# EAGLE schematic cryobondr-qbit2-pqc (EAGLE 6.1)
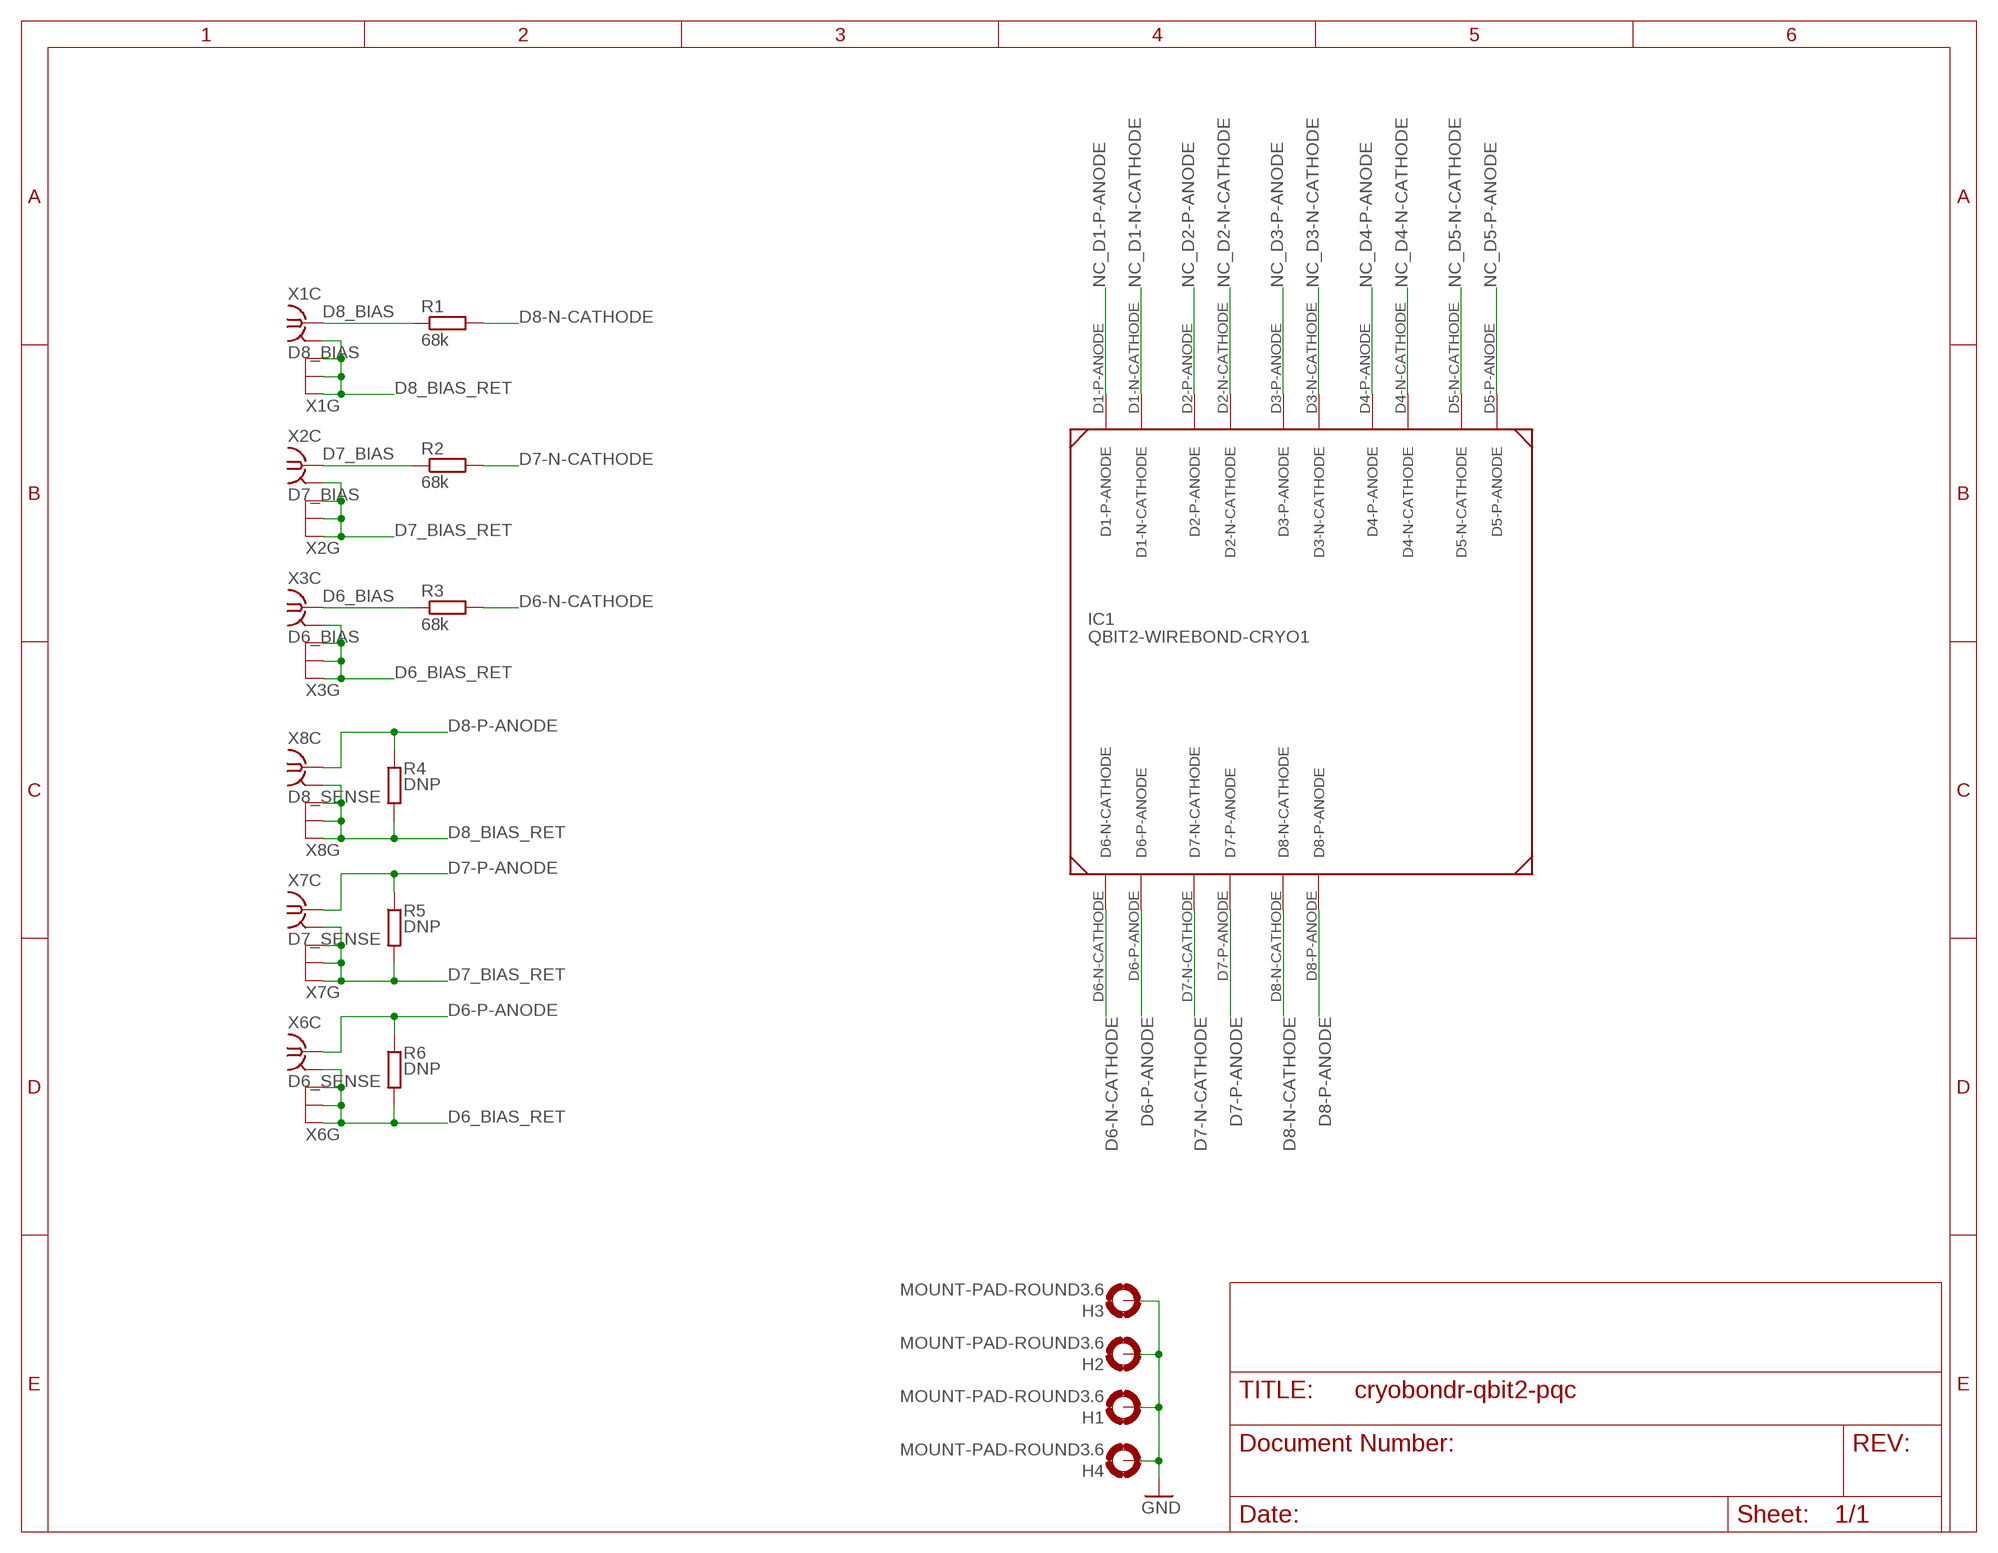
[diagram p0: schematic, sheet 1]

## Parts
H1  MOUNT-PAD-ROUND3.6  [3,6-PAD]
H2  MOUNT-PAD-ROUND3.6  [3,6-PAD]
H3  MOUNT-PAD-ROUND3.6  [3,6-PAD]
H4  MOUNT-PAD-ROUND3.6  [3,6-PAD]
IC1  QBIT2-WIREBOND-CRYO1  [QBIT2-WIREBOND-CRYO1]
R1  68k  R-EU_R0603  [R0603]
R2  68k  R-EU_R0603  [R0603]
R3  68k  R-EU_R0603  [R0603]
R4  DNP  R-EU_R0603  [R0603]
R5  DNP  R-EU_R0603  [R0603]
R6  DNP  R-EU_R0603  [R0603]
X1  D8_BIAS  MMCX  [MMCX-SMT]
X2  D7_BIAS  MMCX  [MMCX-SMT]
X3  D6_BIAS  MMCX  [MMCX-SMT]
X6  D6_SENSE  MMCX  [MMCX-SMT]
X7  D7_SENSE  MMCX  [MMCX-SMT]
X8  D8_SENSE  MMCX  [MMCX-SMT]

## Nets
D6-N-CATHODE: IC1.D6-N-CATHODE R3.2
D6-P-ANODE: IC1.D6-P-ANODE R6.1 X6.S
D6_BIAS: R3.1 X3.S
D6_BIAS_RET: R6.2 X3.G1(C:GND) X3.G2(G:GND) X3.G3(G:GND) X3.G4(G:GND) X6.G1(C:GND) X6.G2(G:GND) X6.G3(G:GND) X6.G4(G:GND)
D7-N-CATHODE: IC1.D7-N-CATHODE R2.2
D7-P-ANODE: IC1.D7-P-ANODE R5.1 X7.S
D7_BIAS: R2.1 X2.S
D7_BIAS_RET: R5.2 X2.G1(C:GND) X2.G2(G:GND) X2.G3(G:GND) X2.G4(G:GND) X7.G1(C:GND) X7.G2(G:GND) X7.G3(G:GND) X7.G4(G:GND)
D8-N-CATHODE: IC1.D8-N-CATHODE R1.2
D8-P-ANODE: IC1.D8-P-ANODE R4.1 X8.S
D8_BIAS: R1.1 X1.S
D8_BIAS_RET: R4.2 X1.G1(C:GND) X1.G2(G:GND) X1.G3(G:GND) X1.G4(G:GND) X8.G1(C:GND) X8.G2(G:GND) X8.G3(G:GND) X8.G4(G:GND)
GND: H1.B3,6(MOUNT) H2.B3,6(MOUNT) H3.B3,6(MOUNT) H4.B3,6(MOUNT)
NC_D1-N-CATHODE: IC1.D1-N-CATHODE
NC_D1-P-ANODE: IC1.D1-P-ANODE
NC_D2-N-CATHODE: IC1.D2-N-CATHODE
NC_D2-P-ANODE: IC1.D2-P-ANODE
NC_D3-N-CATHODE: IC1.D3-N-CATHODE
NC_D3-P-ANODE: IC1.D3-P-ANODE
NC_D4-N-CATHODE: IC1.D4-N-CATHODE
NC_D4-P-ANODE: IC1.D4-P-ANODE
NC_D5-N-CATHODE: IC1.D5-N-CATHODE
NC_D5-P-ANODE: IC1.D5-P-ANODE

## Library data of the parts
H1-H4 = holes:MOUNT-PAD-ROUND: MOUNTING PAD, round
IC1 = meng:QBIT2-WIREBOND-CRYO1
R1-R6 = resistor:R-EU_: RESISTOR, European symbol
X1-X3 X6-X8 = meng:MMCX